# EAGLE design mocd208m (EAGLE 9.3.2)
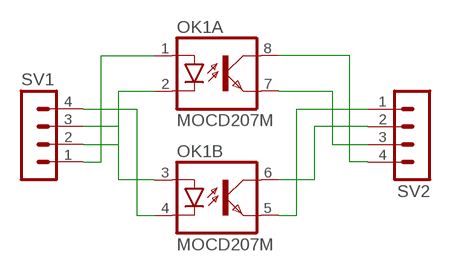
[diagram p0: schematic, sheet 1]

## Parts
OK1  MOCD207M  [SOIC08-FAIRCHILD]
SV1  MA04-1  [MA04-1]
SV2  MA04-1  [MA04-1]

## Nets
N$1: OK1.4(B:C) SV1.4
N$2: OK1.3(B:A) SV1.3
N$3: OK1.2(A:C) SV1.2
N$4: OK1.1(A:A) SV1.1
N$5: OK1.8(A:COL) SV2.4
N$6: OK1.7(A:EMIT) SV2.3
N$7: OK1.6(B:COL) SV2.2
N$8: OK1.5(B:EMIT) SV2.1

## Library data of the parts
OK1 = optocoupler:MOCD20*M: MOCD207M, MOCD208M Dual Channel Phototransistor Small Outline Surface Mount Optocouplers Source: Data sheet <http://www.fairchildsemi.com/ds/MO%2FMOCD207-M.pdf>; MF: FAIRCHILD SEMICONDUCTOR; MPN: MOCD207-M; OC_FARNELL: 1623297; OC_NEWARK: 67K0803
SV1 SV2 = con-lstb:MA04-1: PIN HEADER; OC_FARNELL: unknown; OC_NEWARK: unknown

## Board
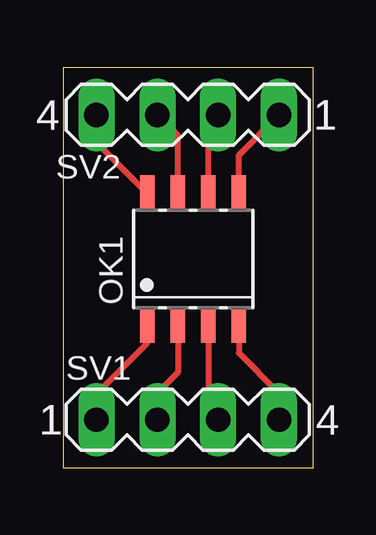
[diagram p1: board, top side]

Size 10.42 x 16.65 mm. Coordinates in mm from the lower left corner, seen from the top.
Outline: 0,0 10.42,0 10.42,16.65 0,16.65 0,0
Copper layers (1*16): Top 0.035559375mm / dielectric 1.6mm / Bottom 0.035559375mm
Design rules "oshpark-2layer": minimum track width 6mil, minimum drill 10mil, track to track 6mil, track to pad 6mil, pad to pad 6mil, via to via 6mil, smd to smd 6mil, copper to edge 15mil, drill to drill 6mil, minimum pad ring 5mil, minimum via ring 5mil, stop-mask expansion 2.5mil, vias tented up to drill 0mil, thermal gap 10mil

### Footprints (pad centres in the part's own frame; a part is rotated, then mirrored left to right if it is on the bottom)
SOIC08-FAIRCHILD = smd 0.61 x 1.52: 1 -1.905,-2.723; 2 -0.635,-2.723; 3 0.635,-2.723; 4 1.905,-2.723; 5 1.905,2.723; 6 0.635,2.723; 7 -0.635,2.723; 8 -1.905,2.723
MA04-1 = drill 1.016 long: 1 -3.81,0; 2 -1.27,0; 3 1.27,0; 4 3.81,0

### Placement (x,y rotation side)
OK1  5.41,8.69 0 top
SV1  5.19,2 0 top
SV2  5.19,14.7 180 top

### Tracks (layer width: path | path; a pad name or v marks a point on that pad's centre or on a via)
N$1
  Top 0.254: OK1.4 7.32,4.78 9,3.1 SV1.4
N$2
  Top 0.254: OK1.3 6.05,2.41 SV1.3
N$3
  Top 0.254: OK1.2 4.78,3.98 3.92,3.12 SV1.2
N$4
  Top 0.254: OK1.1 3.51,5.21 1.38,3.08 SV1.1
N$5
  Top 0.254: OK1.8 1.38,13.54 SV2.4
N$6
  Top 0.254: OK1.7 4.78,13.84 SV2.3
N$7
  Top 0.254: OK1.6 6.05,14.28 SV2.2
N$8
  Top 0.254: OK1.5 7.32,13.01 SV2.1